# Altium schematic sheet Connector A.SchDoc
size A4; SheetNumber: 2; SheetTotal: 11
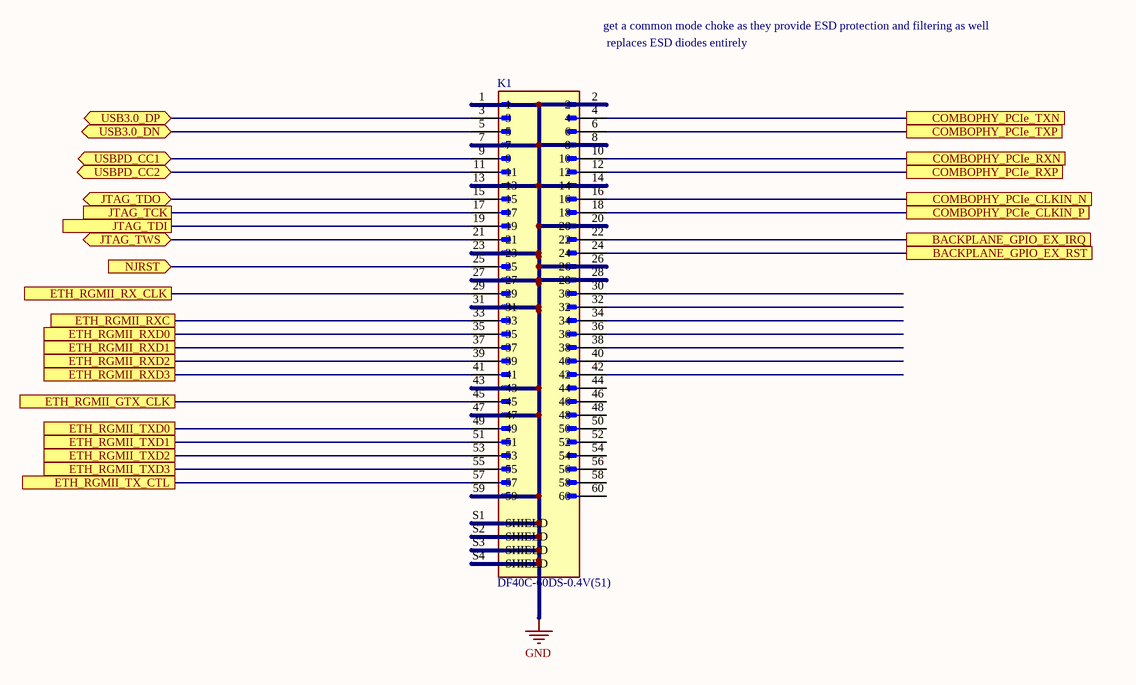
[diagram p0: Connector A.SchDoc]

## Parts
K1  DF40C-60DS-0.4V(51)  [DF40C-60DS-0.4V(51)]

## Ports
BACKPLANE_GPIO_EX_IRQ, BACKPLANE_GPIO_EX_RST, COMBOPHY_PCIe_CLKIN_N, COMBOPHY_PCIe_CLKIN_P, COMBOPHY_PCIe_RXN, COMBOPHY_PCIe_RXP, COMBOPHY_PCIe_TXN, COMBOPHY_PCIe_TXP, ETH_RGMII_GTX_CLK, ETH_RGMII_RX_CLK, ETH_RGMII_RXC, ETH_RGMII_RXD0, ETH_RGMII_RXD1, ETH_RGMII_RXD2, ETH_RGMII_RXD3, ETH_RGMII_TX_CTL, ETH_RGMII_TXD0, ETH_RGMII_TXD1, ETH_RGMII_TXD2, ETH_RGMII_TXD3, JTAG_TCK, JTAG_TDI, JTAG_TDO (bidir), JTAG_TWS (bidir), NJRST (in), USB3.0_DN (bidir), USB3.0_DP (bidir), USBPD_CC1 (bidir), USBPD_CC2 (bidir)

## Nets
GND: K1.1 K1.2 K1.7 K1.8 K1.13 K1.14 K1.20 K1.23 K1.26 K1.27 K1.28 K1.31 K1.43 K1.47 K1.59 K1.S1(SHIELD) K1.S2(SHIELD) K1.S3(SHIELD) K1.S4(SHIELD)
BACKPLANE_GPIO_EX_IRQ: K1.22 ; port BACKPLANE_GPIO_EX_IRQ
BACKPLANE_GPIO_EX_RST: K1.24 ; port BACKPLANE_GPIO_EX_RST
COMBOPHY_PCIe_CLKIN_N: K1.16 ; port COMBOPHY_PCIe_CLKIN_N
COMBOPHY_PCIe_CLKIN_P: K1.18 ; port COMBOPHY_PCIe_CLKIN_P
COMBOPHY_PCIe_RXN: K1.10 ; port COMBOPHY_PCIe_RXN
COMBOPHY_PCIe_RXP: K1.12 ; port COMBOPHY_PCIe_RXP
COMBOPHY_PCIe_TXN: K1.4 ; port COMBOPHY_PCIe_TXN
COMBOPHY_PCIe_TXP: K1.6 ; port COMBOPHY_PCIe_TXP
ETH_RGMII_GTX_CLK: K1.45 ; port ETH_RGMII_GTX_CLK
ETH_RGMII_RX_CLK: K1.29 ; port ETH_RGMII_RX_CLK
ETH_RGMII_RXC: K1.33 ; port ETH_RGMII_RXC
ETH_RGMII_RXD0: K1.35 ; port ETH_RGMII_RXD0
ETH_RGMII_RXD1: K1.37 ; port ETH_RGMII_RXD1
ETH_RGMII_RXD2: K1.39 ; port ETH_RGMII_RXD2
ETH_RGMII_RXD3: K1.41 ; port ETH_RGMII_RXD3
ETH_RGMII_TX_CTL: K1.57 ; port ETH_RGMII_TX_CTL
ETH_RGMII_TXD0: K1.49 ; port ETH_RGMII_TXD0
ETH_RGMII_TXD1: K1.51 ; port ETH_RGMII_TXD1
ETH_RGMII_TXD2: K1.53 ; port ETH_RGMII_TXD2
ETH_RGMII_TXD3: K1.55 ; port ETH_RGMII_TXD3
JTAG_TCK: K1.17 ; port JTAG_TCK
JTAG_TDI: K1.19 ; port JTAG_TDI
JTAG_TDO: K1.15 ; port JTAG_TDO
JTAG_TWS: K1.21 ; port JTAG_TWS
NJRST: K1.25 ; port NJRST
USB3.0_DN: K1.5 ; port USB3.0_DN
USB3.0_DP: K1.3 ; port USB3.0_DP
USBPD_CC1: K1.9 ; port USBPD_CC1
USBPD_CC2: K1.11 ; port USBPD_CC2

Not connected (* = marked no-connect by the designer): K1 30 32 34 36 38 40 42 44 46 48 50 52 54 56 58 60

## Notes on the sheet
- get a common mode choke as they provide ESD protection and filtering as well
- replaces ESD diodes entirely

## Library data of the parts
K1 = DF40C-60DS-0.4V(51): 60 Position Connector Receptacle, Center Strip Contacts Surface Mount Gold